# Altium schematic sheet voltage_measurement.SchDoc
size A4; Date: 08.06.2024; ApprovedBy: Jan Macheta; Author: Mikołaj Pichita; SheetNumber: 3; SheetTotal: 8
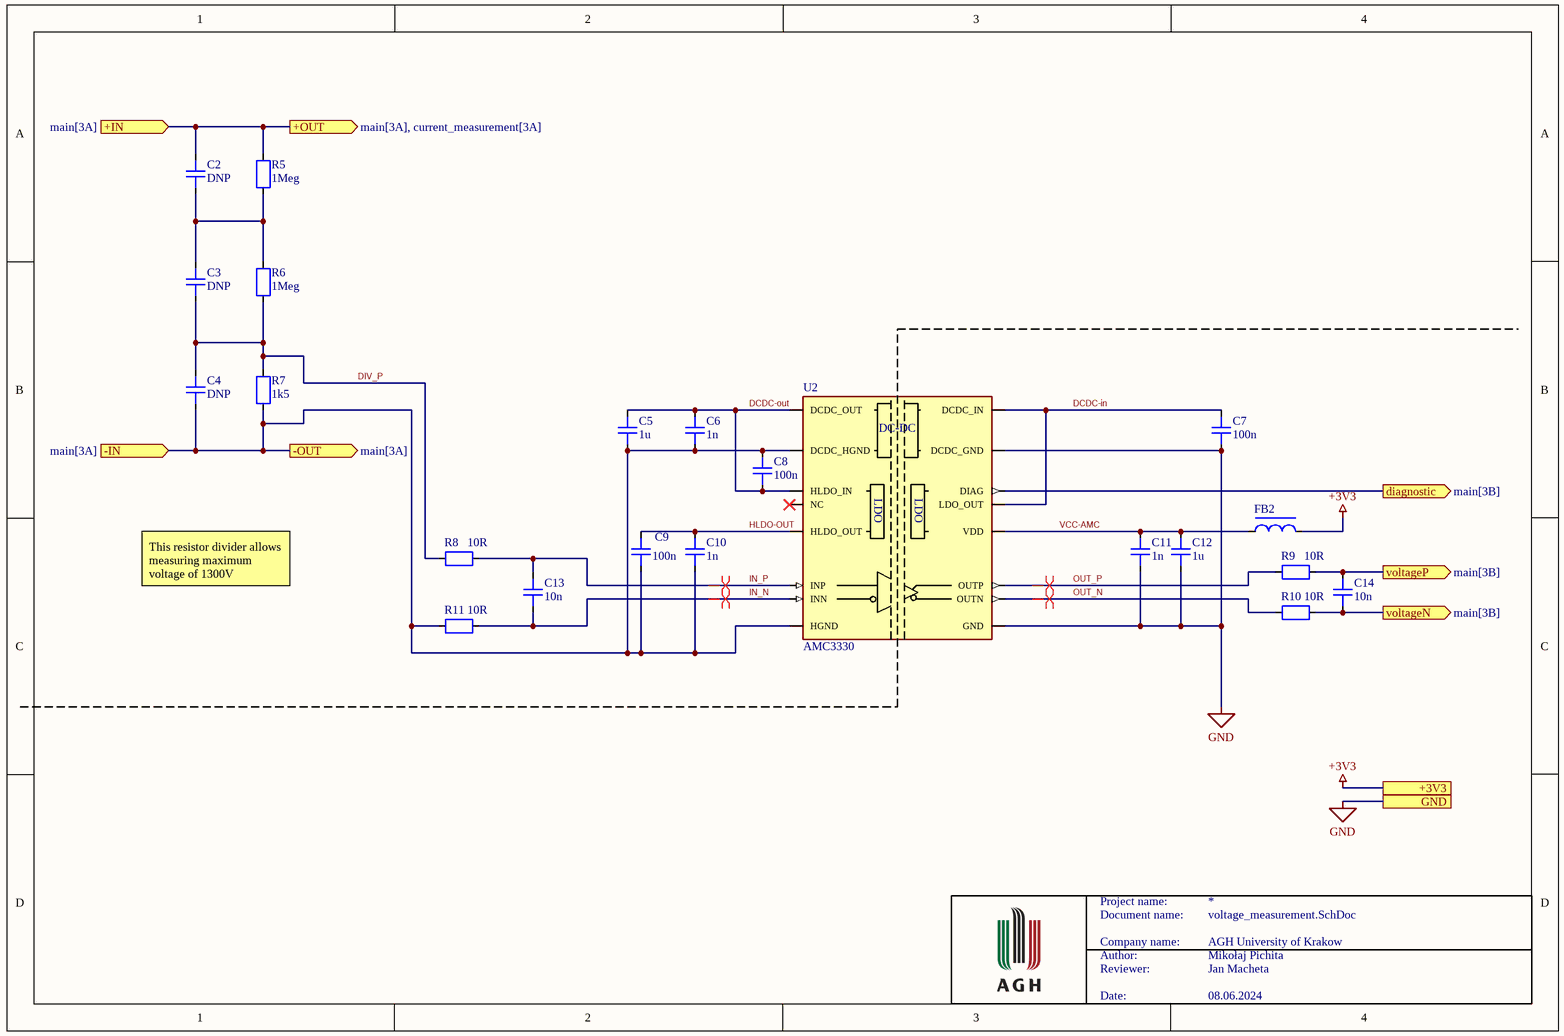
[diagram p0: voltage_measurement.SchDoc]

## Parts
C2  DNP  [CAP1206]
C3  DNP  [CAP1206]
C4  DNP  [CAP1206]
C5  1u  [CAP0603]
C6  1n  [CAP0603]
C7  100n  [CAP0603]
C8  100n  [CAP0603]
C9  100n  [CAP1206]
C10  1n  [CAP1206]
C11  1n  [CAP1206]
C12  1u  [CAP1206]
C13  10n  [CAP0603]
C14  10n  [CAP0603]
FB2  *  [FB0402]  (value not drawn)
R5  1Meg  [RESC3215X06N]
R6  1Meg  [RESC3215X06N]
R7  1k5  [RESC3215X06N]
R8  10R  [RES0603]
R9  10R  [RES0603]
R10  10R  [RES0603]
R11  10R  [RES0603]
U2  AMC3330  [SOIC127P1030X265-16N]

## Ports
+3V3 (see main[3A], analog[4A], current_measurement[1C], microcontroller[4A], power[2A], UART[1A]), +IN (in, see main[3A]), +OUT (out, see main[3A], current_measurement[3A]), -IN (in, see main[3A]), -OUT (out, see main[3A]), diagnostic (out, see main[3B]), GND (see main[3B], analog[4A], current_measurement[1C], microcontroller[4A], power[2B], UART[1A]), voltageN (out, see main[3B]), voltageP (out, see main[3B])

## Nets
+3V3: FB2.2 ; port +3V3
GND: C7.2 C11.2 C12.2 U2.9(GND) U2.15(DCDC_GND) ; port GND
+IN: C2.1 R5.1 ; port +IN, port +OUT
-IN: C4.2 C5.2 C6.2 C8.1 C9.2 C10.2 R7.2 R11.1 U2.2(DCDC_HGND) U2.8(HGND) ; port -IN, port -OUT
DCDC-in: C7.1 U2.13(LDO_OUT) U2.16(DCDC_IN)
DCDC-out: C5.1 C6.1 C8.2 U2.1(DCDC_OUT) U2.3(HLDO_IN)
diagnostic: U2.14(DIAG) ; port diagnostic
DIV_P: C3.2 C4.1 R6.2 R7.1 R8.1
HLDO-OUT: C9.1 C10.1 U2.5(HLDO_OUT)
IN_N: C13.2 R11.2 U2.7(INN)
IN_P: C13.1 R8.2 U2.6(INP)
OUT_N: R10.2 U2.10(OUTN)
OUT_P: R9.2 U2.11(OUTP)
VCC-AMC: C11.1 C12.1 FB2.1 U2.12(VDD)
voltageN: C14.1 R10.1 ; port voltageN
voltageP: C14.2 R9.1 ; port voltageP
NetC2_2: C2.2 C3.1 R5.2 R6.1

Not connected (* = marked no-connect by the designer): U2 4(NC)*

## Layout directives
differential pair: IN_N, IN_P, OUT_N, OUT_P

## Notes on the sheet
- This resistor divider allows measuring maximum voltage of 1300V
- Project name:
- Document name:
- Company name:
- Author:
- Reviewer:
- AGH University of Krakow
- Date:
- (in symbol AMC3330) DC-DC; LDO

## Library data of the parts
C2-C14 = Capacitor: Value: *; HelpURL: *; MPN: *; Supplier: *; SupplierPartNumber: *
  C5 C12: Supplier 1: Mouser; Supplier Part Number 1: 581-12065C105K4Z4A
  C6 C10: Supplier 1: Mouser; Supplier Part Number 1: 581-0603YC102J4T2A
  C7-C9: Supplier 1: Mouser; Supplier Part Number 1: 581-06035C104KAT2A
  C11: Supplier 1: Mouser; Supplier Part Number 1: 581-1206GC102KAT3A
  C14: Supplier 1: Mouser; Supplier Part Number 1: 581-06035C103K
FB2 = Ferrite Bead: Value: *; HelpURL: *; MPN: *; Supplier: *; SupplierPartNumber: *
R5-R11 = Resistor: Value: *; HelpURL: *; MPN: *; Supplier: *; SupplierPartNumber: *
  R9 R10: Supplier 1: Mouser; Supplier Part Number 1: 603-RP0603BRD0710RL
U2 = AMC3330: ±1-V input, precision voltage sensing reinforced isolated amplifier with integrated DC/DC; Value: *; HelpURL: *; MPN: *; Supplier: *; SupplierPartNumber: *